# Altium schematic sheet A1-MAIN.SchDoc
size A2; SheetNumber: 1; SheetTotal: 1
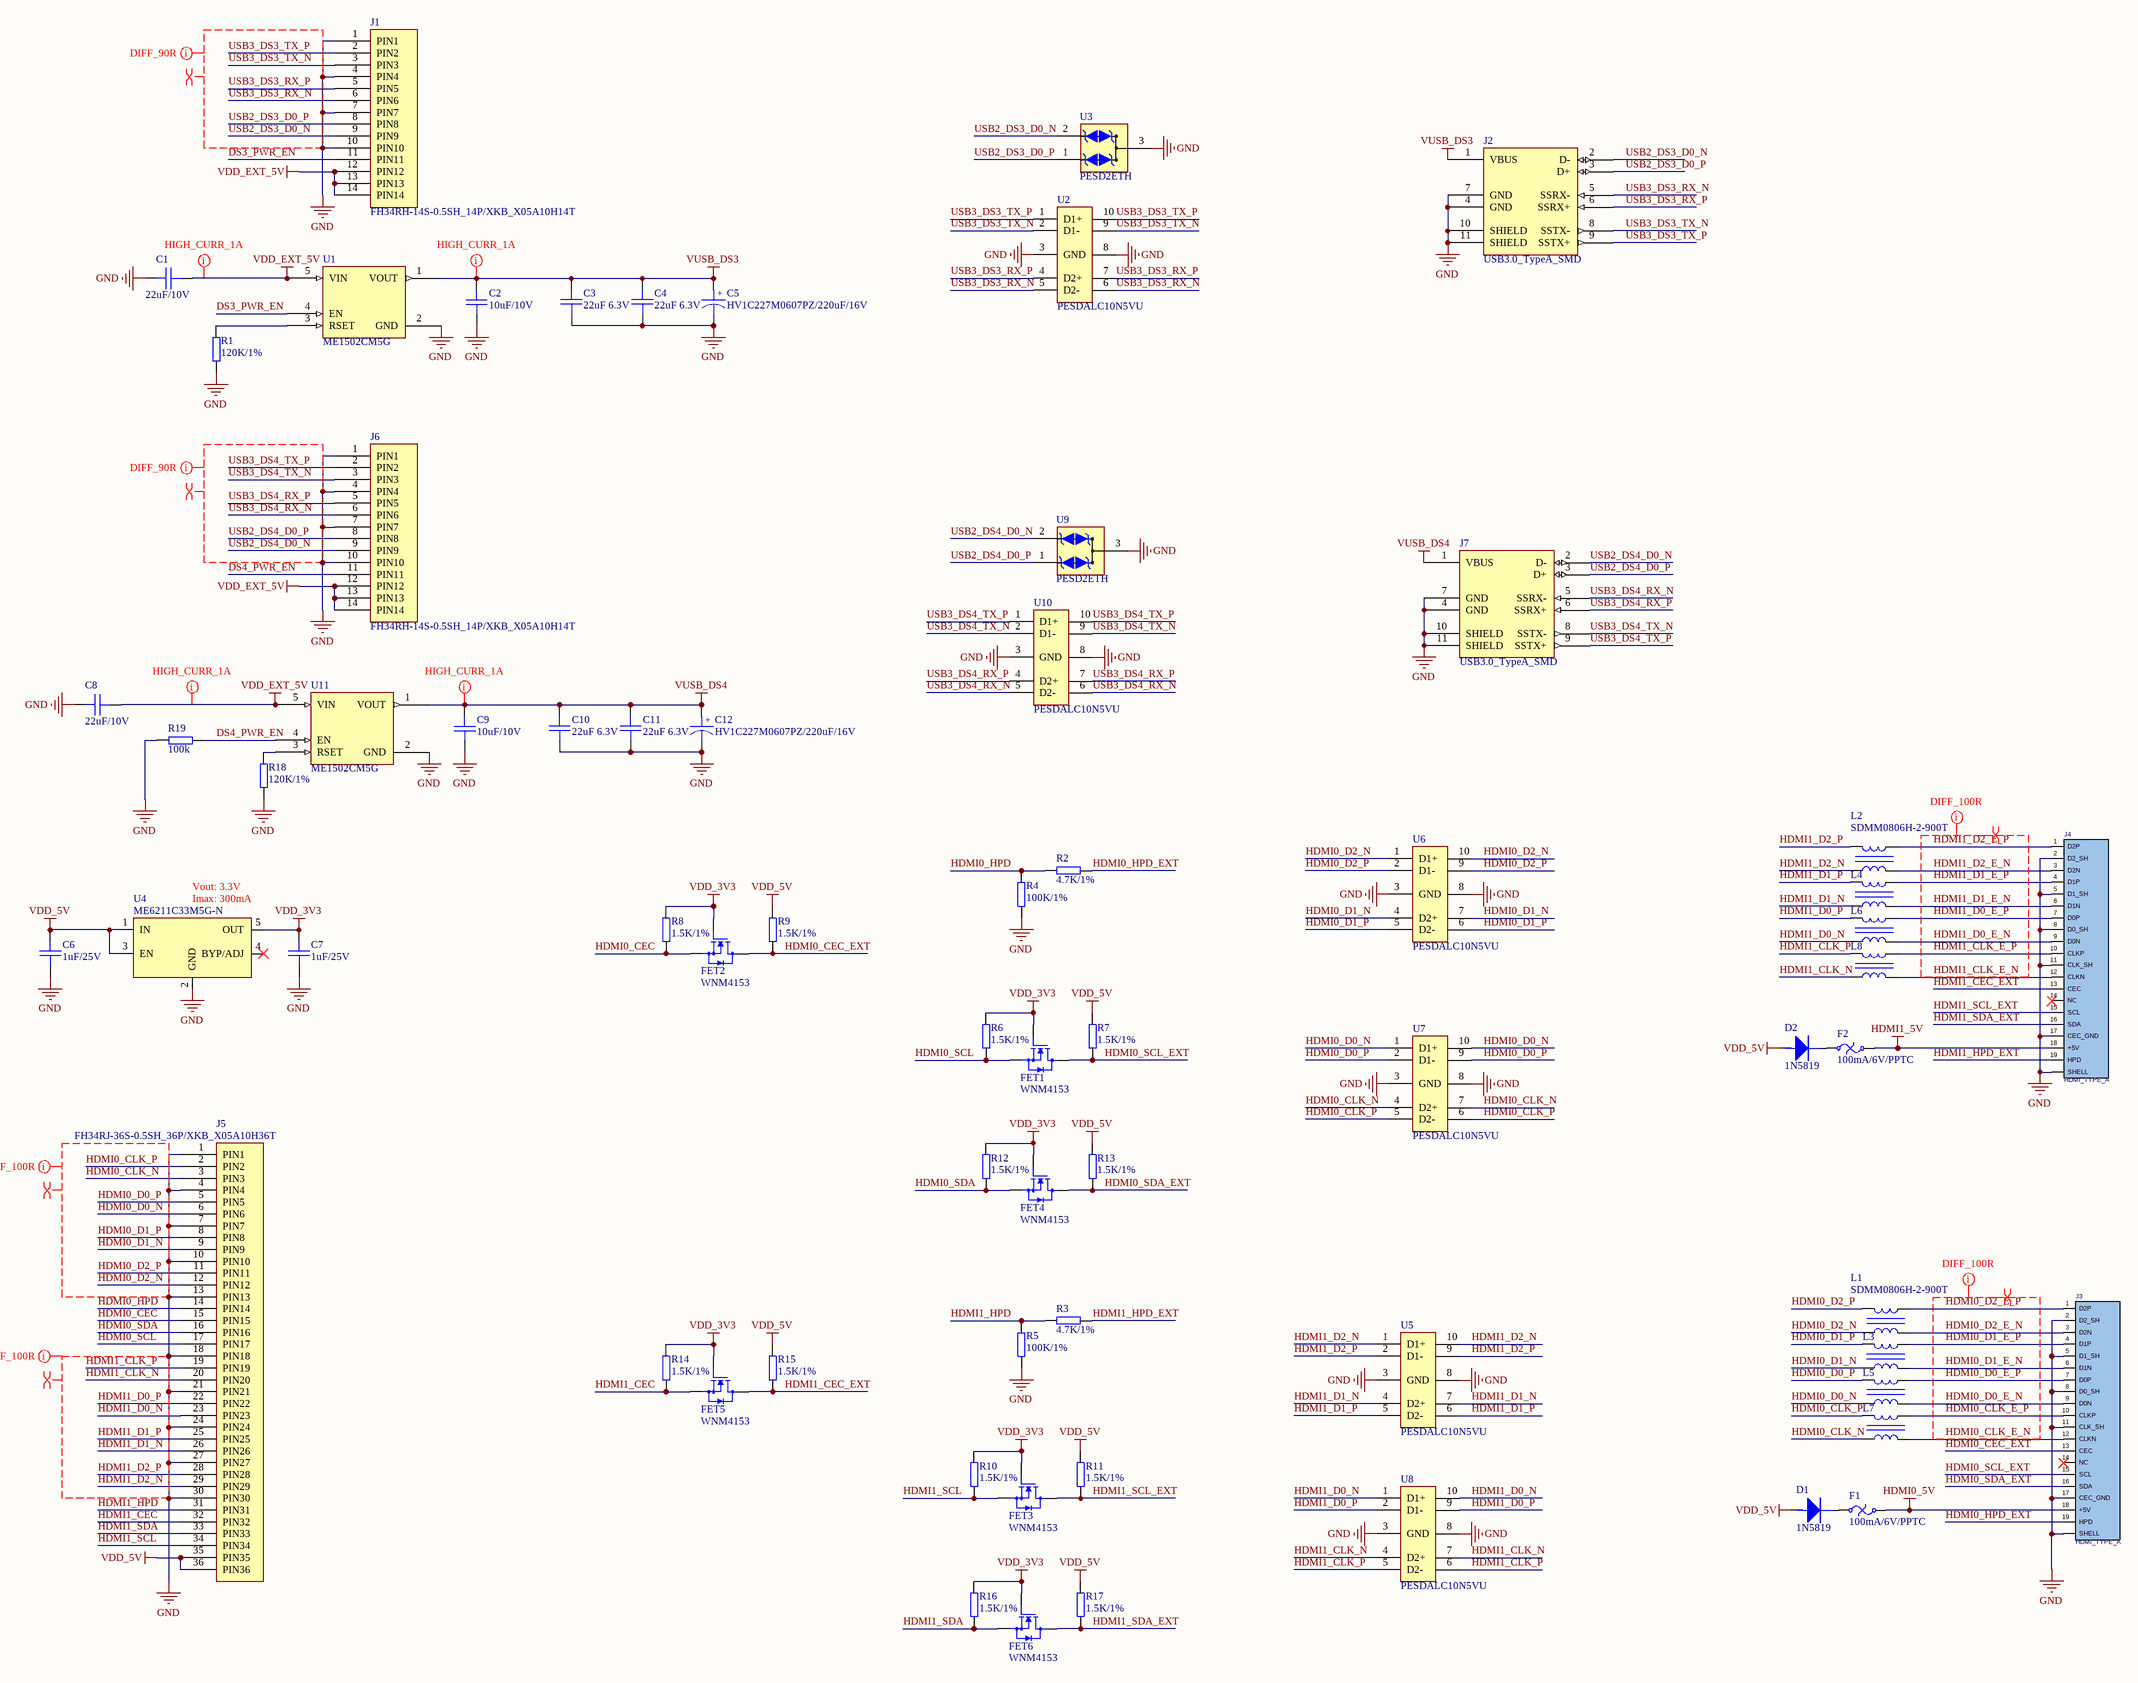
[diagram p0: A1-MAIN.SchDoc]

## Parts
C1  22uF/10V  [C0603-L-HD]
C2  10uF/10V  [C0402-L-HD]
C3  22uF 6.3V  [C0603-L-HD]
C4  22uF 6.3V  [C0603-L-HD]
C5  HV1C227M0607PZ/220uF/16V  [SMT_C_CYLINDER_D_6.3MM]
C6  1uF/25V  [C0402-HD]
C7  1uF/25V  [C0402-HD]
C8  22uF/10V  [C0603-L-HD]
C9  10uF/10V  [C0402-L-HD]
C10  22uF 6.3V  [C0603-L-HD]
C11  22uF 6.3V  [C0603-L-HD]
C12  HV1C227M0607PZ/220uF/16V  [SMT_C_CYLINDER_D_6.3MM]
D1  1N5819  [SMT_DIODE_SOD_323]
D2  1N5819  [SMT_DIODE_SOD_323]
F1  100mA/6V/PPTC  [SMT_FUSE_0805]
F2  100mA/6V/PPTC  [SMT_FUSE_0805]
FET1  WNM4153  [SOT-233-HD]
FET2  WNM4153  [SOT-233-HD]
FET3  WNM4153  [SOT-233-HD]
FET4  WNM4153  [SOT-233-HD]
FET5  WNM4153  [SOT-233-HD]
FET6  WNM4153  [SOT-233-HD]
J1  FH34RH-14S-0.5SH_14P/XKB_X05A10H14T  [FH34RH-14S-0.5SH_14P]
J2  USB3.0_TypeA_SMD  [USB-3.0-SMD_U-A-39DS-Y-1]
J3  HDMI_TYPE_A  [CON_HDMI_A_SMD]
J4  HDMI_TYPE_A  [CON_HDMI_A_SMD]
J5  FH34RJ-36S-0.5SH_36P/XKB_X05A10H36T  [FH34RJ-36S-0.5SH_36P]
J6  FH34RH-14S-0.5SH_14P/XKB_X05A10H14T  [FH34RH-14S-0.5SH_14P]
J7  USB3.0_TypeA_SMD  [USB-3.0-SMD_U-A-39DS-Y-1]
L1  SDMM0806H-2-900T  [SDMM0806]
L2  SDMM0806H-2-900T  [SDMM0806]
L3  SDMM0806H-2-900T  [SDMM0806]  (value not drawn)
L4  SDMM0806H-2-900T  [SDMM0806]  (value not drawn)
L5  SDMM0806H-2-900T  [SDMM0806]  (value not drawn)
L6  SDMM0806H-2-900T  [SDMM0806]  (value not drawn)
L7  SDMM0806H-2-900T  [SDMM0806]  (value not drawn)
L8  SDMM0806H-2-900T  [SDMM0806]  (value not drawn)
R1  120K/1%  [R0603-HD]
R2  4.7K/1%  [R0603-HD]
R3  4.7K/1%  [R0603-HD]
R4  100K/1%  [R0603-HD]
R5  100K/1%  [R0603-HD]
R6  1.5K/1%  [R0603-HD]
R7  1.5K/1%  [R0603-HD]
R8  1.5K/1%  [R0603-HD]
R9  1.5K/1%  [R0603-HD]
R10  1.5K/1%  [R0603-HD]
R11  1.5K/1%  [R0603-HD]
R12  1.5K/1%  [R0603-HD]
R13  1.5K/1%  [R0603-HD]
R14  1.5K/1%  [R0603-HD]
R15  1.5K/1%  [R0603-HD]
R16  1.5K/1%  [R0603-HD]
R17  1.5K/1%  [R0603-HD]
R18  120K/1%  [R0603-HD]
R19  100k  [R0603-HD]
U1  ME1502CM5G  [SOT-235-HD]
U2  PESDALC10N5VU  [R-PSON-N10]
U3  PESD2ETH  [SOT-233-HD]
U4  ME6211C33M5G-N  [SOT-235-HD]
U5  PESDALC10N5VU  [R-PSON-N10]
U6  PESDALC10N5VU  [R-PSON-N10]
U7  PESDALC10N5VU  [R-PSON-N10]
U8  PESDALC10N5VU  [R-PSON-N10]
U9  PESD2ETH  [SOT-233-HD]
U10  PESDALC10N5VU  [R-PSON-N10]
U11  ME1502CM5G  [SOT-235-HD]

## Nets
GND: C1.1 C2.2 C3.1 C4.1 C5.2 C6.1 C7.1 C8.1 C9.2 C10.1 C11.1 C12.2 J1.1(PIN1) J1.4(PIN4) J1.7(PIN7) J1.10(PIN10) J2.4(GND) J2.7(GND) J2.10(SHIELD) J2.11(SHIELD) J3.0(SHELL) J3.2(D2_SH) J3.5(D1_SH) J3.8(D0_SH) J3.11(CLK_SH) J3.17(CEC_GND) J4.0(SHELL) J4.2(D2_SH) J4.5(D1_SH) J4.8(D0_SH) J4.11(CLK_SH) J4.17(CEC_GND) J5.1(PIN1) J5.4(PIN4) J5.7(PIN7) J5.10(PIN10) J5.13(PIN13) J5.18(PIN18) J5.21(PIN21) J5.24(PIN24) J5.27(PIN27) J5.30(PIN30) J6.1(PIN1) J6.4(PIN4) J6.7(PIN7) J6.10(PIN10) J7.4(GND) J7.7(GND) J7.10(SHIELD) J7.11(SHIELD) R1.2 R4.1 R5.1 R18.2 R19.1 U1.2(GND) U2.3(GND) U2.8(GND) U3.3(GND) U4.2(GND) U5.3(GND) U5.8(GND) U6.3(GND) U6.8(GND) U7.3(GND) U7.8(GND) U8.3(GND) U8.8(GND) U9.3(GND) U10.3(GND) U10.8(GND) U11.2(GND)
HDMI0_5V: F1.2 J3.18(+5V)
HDMI1_5V: F2.2 J4.18(+5V)
VDD_3V3: C7.2 FET1.1(G) FET2.1(G) FET3.1(G) FET4.1(G) FET5.1(G) FET6.1(G) R6.1 R8.1 R10.1 R12.1 R14.1 R16.1 U4.5(OUT)
VDD_5V: C6.2 D1.1(A) D2.1(A) J5.35(PIN35) J5.36(PIN36) R7.1 R9.1 R11.1 R13.1 R15.1 R17.1 U4.1(IN) U4.3(EN)
VDD_EXT_5V: C1.2 C8.2 J1.12(PIN12) J1.13(PIN13) J1.14(PIN14) J6.12(PIN12) J6.13(PIN13) J6.14(PIN14) U1.5(VIN) U11.5(VIN)
VUSB_DS3: C2.1 C3.2 C4.2 C5.1 J2.1(VBUS) U1.1(VOUT)
VUSB_DS4: C9.1 C10.2 C11.2 C12.1 J7.1(VBUS) U11.1(VOUT)
DS3_PWR_EN: J1.11(PIN11) U1.4(EN)
DS4_PWR_EN: J6.11(PIN11) R19.2 U11.4(EN)
HDMI0_CEC: FET2.2(S) J5.15(PIN15) R8.2
HDMI0_CEC_EXT: FET2.3(D) J3.13(CEC) R9.2
HDMI0_CLK_E_N: J3.12(CLKN) L7.3
HDMI0_CLK_E_P: J3.10(CLKP) L7.4
HDMI0_CLK_N: J5.3(PIN3) L7.2 U7.4(D2+) U7.7(D2-)
HDMI0_CLK_P: J5.2(PIN2) L7.1 U7.5(D2-) U7.6(D2-)
HDMI0_D0_E_N: J3.9(D0N) L5.3
HDMI0_D0_E_P: J3.7(D0P) L5.4
HDMI0_D0_N: J5.6(PIN6) L5.2 U7.1(D1+) U7.10(D2-)
HDMI0_D0_P: J5.5(PIN5) L5.1 U7.2(D1-) U7.9(D2-)
HDMI0_D1_E_N: J3.6(D1N) L3.3
HDMI0_D1_E_P: J3.4(D1P) L3.4
HDMI0_D1_N: J5.9(PIN9) L3.2 U6.4(D2+) U6.7(D2-)
HDMI0_D1_P: J5.8(PIN8) L3.1 U6.5(D2-) U6.6(D2-)
HDMI0_D2_E_N: J3.3(D2N) L1.3
HDMI0_D2_E_P: J3.1(D2P) L1.4
HDMI0_D2_N: J5.12(PIN12) L1.2 U6.1(D1+) U6.10(D2-)
HDMI0_D2_P: J5.11(PIN11) L1.1 U6.2(D1-) U6.9(D2-)
HDMI0_HPD: J5.14(PIN14) R2.2 R4.2
HDMI0_HPD_EXT: J3.19(HPD) R2.1
HDMI0_SCL: FET1.2(S) J5.17(PIN17) R6.2
HDMI0_SCL_EXT: FET1.3(D) J3.15(SCL) R7.2
HDMI0_SDA: FET4.2(S) J5.16(PIN16) R12.2
HDMI0_SDA_EXT: FET4.3(D) J3.16(SDA) R13.2
HDMI1_CEC: FET5.2(S) J5.32(PIN32) R14.2
HDMI1_CEC_EXT: FET5.3(D) J4.13(CEC) R15.2
HDMI1_CLK_E_N: J4.12(CLKN) L8.3
HDMI1_CLK_E_P: J4.10(CLKP) L8.4
HDMI1_CLK_N: J5.20(PIN20) L8.2 U8.4(D2+) U8.7(D2-)
HDMI1_CLK_P: J5.19(PIN19) L8.1 U8.5(D2-) U8.6(D2-)
HDMI1_D0_E_N: J4.9(D0N) L6.3
HDMI1_D0_E_P: J4.7(D0P) L6.4
HDMI1_D0_N: J5.23(PIN23) L6.2 U8.1(D1+) U8.10(D2-)
HDMI1_D0_P: J5.22(PIN22) L6.1 U8.2(D1-) U8.9(D2-)
HDMI1_D1_E_N: J4.6(D1N) L4.3
HDMI1_D1_E_P: J4.4(D1P) L4.4
HDMI1_D1_N: J5.26(PIN26) L4.2 U5.4(D2+) U5.7(D2-)
HDMI1_D1_P: J5.25(PIN25) L4.1 U5.5(D2-) U5.6(D2-)
HDMI1_D2_E_N: J4.3(D2N) L2.3
HDMI1_D2_E_P: J4.1(D2P) L2.4
HDMI1_D2_N: J5.29(PIN29) L2.2 U5.1(D1+) U5.10(D2-)
HDMI1_D2_P: J5.28(PIN28) L2.1 U5.2(D1-) U5.9(D2-)
HDMI1_HPD: J5.31(PIN31) R3.2 R5.2
HDMI1_HPD_EXT: J4.19(HPD) R3.1
HDMI1_SCL: FET3.2(S) J5.34(PIN34) R10.2
HDMI1_SCL_EXT: FET3.3(D) J4.15(SCL) R11.2
HDMI1_SDA: FET6.2(S) J5.33(PIN33) R16.2
HDMI1_SDA_EXT: FET6.3(D) J4.16(SDA) R17.2
USB2_DS3_D0_N: J1.9(PIN9) J2.2(D-) U3.2(3D)
USB2_DS3_D0_P: J1.8(PIN8) J2.3(D+) U3.1(4D)
USB2_DS4_D0_N: J6.9(PIN9) J7.2(D-) U9.2(3D)
USB2_DS4_D0_P: J6.8(PIN8) J7.3(D+) U9.1(4D)
USB3_DS3_RX_N: J1.6(PIN6) J2.5(SSRX-) U2.5(D2-) U2.6(D2-)
USB3_DS3_RX_P: J1.5(PIN5) J2.6(SSRX+) U2.4(D2+) U2.7(D2-)
USB3_DS3_TX_N: J1.3(PIN3) J2.8(SSTX-) U2.2(D1-) U2.9(D2-)
USB3_DS3_TX_P: J1.2(PIN2) J2.9(SSTX+) U2.1(D1+) U2.10(D2-)
USB3_DS4_RX_N: J6.6(PIN6) J7.5(SSRX-) U10.5(D2-) U10.6(D2-)
USB3_DS4_RX_P: J6.5(PIN5) J7.6(SSRX+) U10.4(D2+) U10.7(D2-)
USB3_DS4_TX_N: J6.3(PIN3) J7.8(SSTX-) U10.2(D1-) U10.9(D2-)
USB3_DS4_TX_P: J6.2(PIN2) J7.9(SSTX+) U10.1(D1+) U10.10(D2-)
NetD1_2: D1.2(K) F1.1
NetD2_2: D2.2(K) F2.1
NetR1_1: R1.1 U1.3(RSET)
NetR18_1: R18.1 U11.3(RSET)

Not connected (* = marked no-connect by the designer): J3 14(NC)*; J4 14(NC)*; U4 4(BYP/ADJ)*

## Layout directives
mark named DIFF_90R: USB2_DS3_D0_N, USB2_DS3_D0_P, USB2_DS4_D0_N, USB2_DS4_D0_P, USB3_DS3_RX_N, USB3_DS3_RX_P, USB3_DS3_TX_N, USB3_DS3_TX_P, USB3_DS4_RX_N, USB3_DS4_RX_P, USB3_DS4_TX_N, USB3_DS4_TX_P
mark named DIFF_100R: HDMI0_CLK_E_N, HDMI0_CLK_E_P, HDMI0_CLK_N, HDMI0_CLK_P, HDMI0_D0_E_N, HDMI0_D0_E_P, HDMI0_D0_N, HDMI0_D0_P, HDMI0_D1_E_N, HDMI0_D1_E_P, HDMI0_D1_N, HDMI0_D1_P, HDMI0_D2_E_N, HDMI0_D2_E_P, HDMI0_D2_N, HDMI0_D2_P, HDMI1_CLK_E_N, HDMI1_CLK_E_P, HDMI1_CLK_N, HDMI1_CLK_P, HDMI1_D0_E_N, HDMI1_D0_E_P, HDMI1_D0_N, HDMI1_D0_P, HDMI1_D1_E_N, HDMI1_D1_E_P, HDMI1_D1_N, HDMI1_D1_P, HDMI1_D2_E_N, HDMI1_D2_E_P, HDMI1_D2_N, HDMI1_D2_P
differential pair: HDMI0_CLK_E_N, HDMI0_CLK_E_P, HDMI0_CLK_N, HDMI0_CLK_P, HDMI0_D0_E_N, HDMI0_D0_E_P, HDMI0_D0_N, HDMI0_D0_P, HDMI0_D1_E_N, HDMI0_D1_E_P, HDMI0_D1_N, HDMI0_D1_P, HDMI0_D2_E_N, HDMI0_D2_E_P, HDMI0_D2_N, HDMI0_D2_P, HDMI1_CLK_E_N, HDMI1_CLK_E_P, HDMI1_CLK_N, HDMI1_CLK_P, HDMI1_D0_E_N, HDMI1_D0_E_P, HDMI1_D0_N, HDMI1_D0_P, HDMI1_D1_E_N, HDMI1_D1_E_P, HDMI1_D1_N, HDMI1_D1_P, HDMI1_D2_E_N, HDMI1_D2_E_P, HDMI1_D2_N, HDMI1_D2_P, USB2_DS3_D0_N, USB2_DS3_D0_P, USB2_DS4_D0_N, USB2_DS4_D0_P, USB3_DS3_RX_N, USB3_DS3_RX_P, USB3_DS3_TX_N, USB3_DS3_TX_P, USB3_DS4_RX_N, USB3_DS4_RX_P, USB3_DS4_TX_N, USB3_DS4_TX_P
mark named HIGH_CURR_1A: VDD_EXT_5V, VUSB_DS3, VUSB_DS4

## Notes on the sheet
- (near U4) Vout: 3.3V
- (near U4) Imax: 300mA
- (in symbol SMT_C_Cylinder_D_6.3mm) +

## Library data of the parts
C1 C3 C4 C8 C10 C11 = SMT_C_0603: Surface mount capacitor 0603
C2 C6 C7 C9 = SMT_C_0402: Surface mount capacitor 0402
C5 C12 = SMT_C_Cylinder_D_6.3mm: Surface mount cylindrical capacitor-D-6.3mm
D1 D2 = SMT_DIODE_SOD_323: Surface mount diode SOD-323(0805) Package
F1 F2 = SMT_FUSE_0805
FET1-FET6 = SI2302-N-Ch-MOSFET: SI2302-N-Ch,3A, 20V.RDS(ON) = 0.082Ω @ VGS = 2.5 V
J1 J6 = THT_Male_P_1x14: THT Male pin header strip 1x14
J3 J4 = CON_HDMI_TYPE_A
J5 = FPC_CONN_36P
L1-L8 = ACM2012
R1-R19 = SMT_R_0402: Surface mount resistor 0402
U1 U11 = ME1502
U2 U5-U8 U10 = TPD4E05U06
U3 U9 = ESD2CAN
U4 = SPX3819: 500mA, Low-Noise LDO Voltage Regulator